# Altium schematic sheet 3V3_buck.SchDoc
size B; DocumentNumber: 2; SheetNumber: 7; SheetTotal: 7
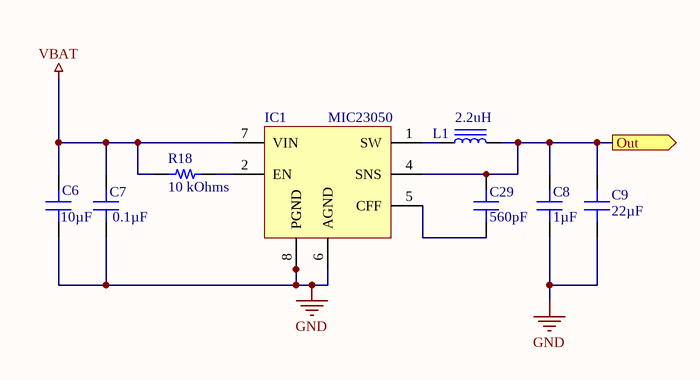
[diagram p0: 3V3_buck.SchDoc]

## Parts
C6  10µF  [CAP 0805_2012]
C7  0.1µF  [CAP 0603_1608]
C8  1µF  [CAP 0603_1608]
C9  22µF  [CAP 0805_2012]
C29  560pF  [CAP 0603_1608]
IC1  MIC23050  [MLF-8 2x2mm]
L1  2.2uH  [IND 0806_2016]
R18  10 kOhms  [RES 0603_1608]

## Ports
Out (out)

## Nets
GND: C6.1 C7.2 C8.1 C9.1 IC1.6(AGND) IC1.8(PGND) IC1.9(PGND)
VBAT: C6.2 C7.1 IC1.7(VIN) R18.2
Out: C8.2 C9.2 C29.2 IC1.4(SNS) L1.2 ; port Out
NetC29_1: C29.1 IC1.5(CFF)
NetIC1_1: IC1.1(SW) L1.1
NetIC1_2: IC1.2(EN) R18.1

## Library data of the parts
C6 = C2012X7S1E106K125AC: CAP CER 10UF 25V X7S 0805; Manufacturer: TDK Corporation; Tolerance: ±10%; Part Number: C2012X7S1E106K125AC; Value: 10µF; Applications: General Purpose; Capacitance: 10µF; ComponentLink1Description: Datasheet; ComponentLink1URL: https://product.tdk.com/en/search/capacitor/ceramic/mlcc/info?part_no=C2012X7S1E106K125AC?ref_disty=digikey; ComponentLink2Description: DigiKey Link; ComponentLink2URL: http://digikey.com/product-detail/en/tdk-corporation/C2012X7S1E106K125AC/445-181600-1-ND/9991478; Device Package: 0805 (2012 Metric); Features: Low ESL; LastUpdated: 21-Jan-20 12:03:04 AM; Lifecycle Status: Active; Minimum Order: 1; Mounting Type: Surface Mount, MLCC; Operating Temperature: -55°C ~ 125°C; Package / Case: 0805 (2012 Metric); Packaging: TapeAndReel; PartId: 3339; Part Status: Active; Price: 0.15; Series: C; Size / Dimension: 0.079" L x 0.049" W (2.00mm x 1.25mm); Supplier 1: DigiKey; Supplier Part Number 1: 445-181600-1-ND; Temperature Coefficient: X7S; Thickness (Max): 0.057" (1.45mm); Voltage - Rated: 25V
C7 = GCG188R92A104KA03D: CAP CER 0.1UF 100V 0603 EPOXY; Manufacturer: Murata Electronics; Temperature Coefficient: X8R; Tolerance: ±10%; Part Number: GCG188R92A104KA03D; Value: 0.1µF; Applications: Automotive; Capacitance: 0.1µF; ComponentLink1Description: Datasheet; ComponentLink1URL: https://search.murata.co.jp/Ceramy/image/img/A01X/G101/ENG/GCG188R92A104KA03-01.pdf; ComponentLink2Description: DigiKey Link; ComponentLink2URL: http://digikey.com/product-detail/en/murata-electronics/GCG188R92A104KA03D/490-18197-1-ND/9867926; Device Package: 0603 (1608 Metric); Features: Epoxy Mountable; LastUpdated: 21-Jan-20 12:01:59 AM; Lifecycle Status: Active; Minimum Order: 1; Mounting Type: Surface Mount, MLCC, Epoxy; Operating Temperature: -55°C ~ 150°C; Package / Case: 0603 (1608 Metric); Packaging: TapeAndReel; PartId: 9025; Part Status: Active; Price: 0.07; Ratings: AEC-Q200; Series: GCG; Size / Dimension: 0.063" L x 0.031" W (1.60mm x 0.80mm); Supplier 1: DigiKey; Supplier Part Number 1: 490-18197-1-ND; Thickness (Max): 0.035" (0.90mm); Voltage - Rated: 100V
C8 = GCJ188R71E105KA01D: CAP CER 1UF 25V X7R 0603; Manufacturer: Murata Electronics; Tolerance: ±10%; Part Number: GCJ188R71E105KA01D; Value: 1µF; Applications: Automotive, Boardflex Sensitive; Capacitance: 1µF; ComponentLink1Description: Datasheet; ComponentLink1URL: https://search.murata.co.jp/Ceramy/image/img/A01X/G101/ENG/GCJ188R71E105KA01-01.pdf; ComponentLink2Description: DigiKey Link; ComponentLink2URL: http://digikey.com/product-detail/en/murata-electronics/GCJ188R71E105KA01D/490-14409-1-ND/6606870; Device Package: 0603 (1608 Metric); Features: Soft Termination; LastUpdated: 21-Jan-20 12:01:58 AM; Lifecycle Status: Active; Minimum Order: 1; Mounting Type: Surface Mount, MLCC; Operating Temperature: -55°C ~ 125°C; Package / Case: 0603 (1608 Metric); Packaging: TapeAndReel; PartId: 9566; Part Status: Active; Price: 0.05; Ratings: AEC-Q200; Series: GCJ; Size / Dimension: 0.063" L x 0.031" W (1.60mm x 0.80mm); Supplier 1: DigiKey; Supplier Part Number 1: 490-14409-1-ND; Temperature Coefficient: X7R; Thickness (Max): 0.035" (0.90mm); Voltage - Rated: 25V
C9 = CL21A226MOQNNNE: CAP CER 22UF 16V X5R 0805; Manufacturer: Samsung Electro-Mechanics; Tolerance: ±20%; Part Number: CL21A226MOQNNNE; Value: 22µF; Applications: General Purpose; Capacitance: 22µF; ComponentLink1Description: Datasheet; ComponentLink1URL: http://www.samsungsem.com/kr/support/product-search/mlcc/CL21A226MOQNNNE.jsp; ComponentLink2Description: DigiKey Link; ComponentLink2URL: http://digikey.com/product-detail/en/samsung-electro-mechanics/CL21A226MOQNNNE/1276-2909-1-ND/3890995; Device Package: 0805 (2012 Metric); LastUpdated: 21-Jan-20 12:03:05 AM; Lifecycle Status: Active; Minimum Order: 1; Mounting Type: Surface Mount, MLCC; Operating Temperature: -55°C ~ 85°C; Package / Case: 0805 (2012 Metric); Packaging: TapeAndReel; PartId: 3052; Part Status: Active; Price: 0.11; Series: CL; Size / Dimension: 0.079" L x 0.049" W (2.00mm x 1.25mm); Supplier 1: DigiKey; Supplier Part Number 1: 1276-2909-1-ND; Temperature Coefficient: X5R; Thickness (Max): 0.055" (1.40mm); Voltage - Rated: 16V
C29 = GCJ188R71E105KA01D: CAP CER 1UF 25V X7R 0603; Manufacturer: Murata Electronics; Capacitance: 1µF; Tolerance: ±10%; Part Number: GCJ188R71E105KA01D; Value: 560pF; Applications: Automotive, Boardflex Sensitive; ComponentLink1Description: Datasheet; ComponentLink1URL: https://search.murata.co.jp/Ceramy/image/img/A01X/G101/ENG/GCJ188R71E105KA01-01.pdf; ComponentLink2Description: DigiKey Link; ComponentLink2URL: http://digikey.com/product-detail/en/murata-electronics/GCJ188R71E105KA01D/490-14409-1-ND/6606870; Device Package: 0603 (1608 Metric); Features: Soft Termination; LastUpdated: 21-Jan-20 12:01:58 AM; Lifecycle Status: Active; Minimum Order: 1; Mounting Type: Surface Mount, MLCC; Operating Temperature: -55°C ~ 125°C; Package / Case: 0603 (1608 Metric); Packaging: TapeAndReel; PartId: 9566; Part Status: Active; Price: 0.05; Ratings: AEC-Q200; Series: GCJ; Size / Dimension: 0.063" L x 0.031" W (1.60mm x 0.80mm); Supplier 1: DigiKey; Supplier Part Number 1: 490-14409-1-ND; Temperature Coefficient: X7R; Thickness (Max): 0.035" (0.90mm); Voltage - Rated: 25V
L1 = LQH2MPN6R8MGRL: FIXED IND 6.8UH 530MA 864 MOHM; Manufacturer: Murata Electronics; Current - Saturation: 730mA; DC Resistance (DCR): 864mOhm Max; Frequency - Self Resonant: 35MHz; Inductance: 6.8µH; Inductance Frequency - Test: 1MHz; Material - Core: Ferrite; Shielding: Shielded; Tolerance: ±20%; Type: Wirewound; Value: 6.8µH; Part Number: LQH2MPN6R8MGRL; ComponentLink1Description: Datasheet; ComponentLink1URL: https://search.murata.co.jp/Ceramy/image/img/P02/JELF243A-0142.pdf; ComponentLink2Description: DigiKey Link; ComponentLink2URL: http://digikey.com/product-detail/en/murata-electronics/LQH2MPN6R8MGRL/490-15920-1-ND/6800585; Current Rating (Amps): 530mA; Device Package: 0806 (2016 Metric); Height - Seated (Max): 0.037" (0.95mm); LastUpdated: 21-Jan-20 3:55:54 AM; Lifecycle Status: Active; Minimum Order: 1; Mounting Type: Surface Mount; Operating Temperature: -40°C ~ 105°C; Package / Case: 0806 (2016 Metric); Packaging: TapeAndReel; PartId: 3181; Part Status: Active; Price: 0.10; Series: LQH2; Size / Dimension: 0.079" L x 0.063" W (2.00mm x 1.60mm); Supplier 1: DigiKey; Supplier Part Number 1: 490-15920-1-ND; Supplier Device Package: 0806 (2016 Metric)
R18 = RNCS0603BKE10K0: RES 10K OHM 0.1% 1/16W 0603; Manufacturer: Stackpole Electronics Inc; Power (Watts): 0.063W, 1/16W; Temperature Coefficient: ±25ppm/°C; Part Number: RNCS0603BKE10K0; Value: 10 kOhms; ComponentLink1Description: Datasheet; ComponentLink1URL: https://www.seielect.com/catalog/sei-rncs_rnch.pdf; ComponentLink2Description: DigiKey Link; ComponentLink2URL: http://digikey.com/product-detail/en/stackpole-electronics-inc/RNCS0603BKE10K0/RNCS0603BKE10K0CT-ND/1800113; Composition: Thin Film; Device Package: 0603 (1608 Metric); Features: Anti-Corrosive, Automotive AEC-Q200, Moisture Resistant; Height - Seated (Max): 0.022" (0.55mm); LastUpdated: 21-Jan-20 12:25:01 AM; Lifecycle Status: Active; Minimum Order: 1; Number of Terminations: 2; Operating Temperature: -55°C ~ 155°C; Package / Case: 0603 (1608 Metric); Packaging: TapeAndReel; PartId: 4838; Part Status: Active; Price: 0.08; Ratings: AEC-Q200; Resistance: 10 kOhms; Series: RNCS; Size / Dimension: 0.061" L x 0.031" W (1.55mm x 0.80mm); Supplier 1: DigiKey; Supplier Part Number 1: RNCS0603BKE10K0CT-ND; Supplier Device Package: 0603; Tolerance: ±0.1%